# Altium schematic sheet SHDN-BSPD-S09-V00-PSU.SchDoc: Power Supply (20-40V to 3v3 @ 0.1-0.6A)
size A3; DrawnBy: Jonn Dillon; DocumentNumber: 9; Revision: 01; SheetNumber: 9; SheetTotal: 12; Version: 01; Project: Battery Management System 2020; PageSetup: Record=PageOptions|CenterHorizontal=True|CenterVertical=True|PrintScale=0.97|XCorrection=1.00|YCorrection=1.00|PrintKind=0|BorderSize=5000000|LeftOffset=0|BottomOffset=0|Orientation=2|PaperLength=1000|PaperWidth=1000|Scale=100|PaperSource=7|PrintQuality=-4|MediaType=1|DitherType=10|PaperKind=A4|PrintScaleMode=1
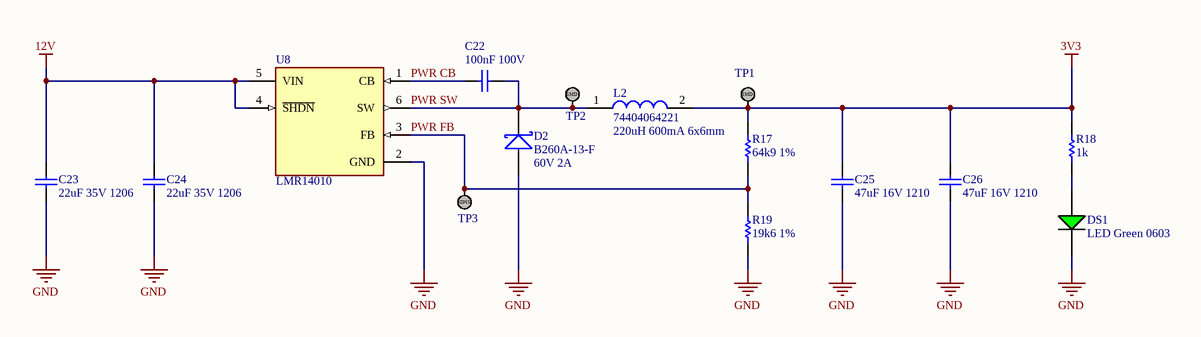
[diagram p0: SHDN-BSPD-S09-V00-PSU.SchDoc]

## Parts
C22  100nF 100V  [Cap_Ceramic_0603]
C23  22uF 35V 1206  [Cap_Ceramic_1206]
C24  22uF 35V 1206  [Cap_Ceramic_1206]
C25  47uF 16V 1210  [Cap_Ceramic_1210]
C26  47uF 16V 1210  [Cap_Ceramic_1210]
D2  B260A-13-F  [SMA]
DS1  LED Green 0603  [LED GREEN 0603]
L2  74404064221  [Inductor_6x6mm]
R17  64k9 1%  [Res_ThinFilm_0603]
R18  1k  [Res_ThinFilm_0603]
R19  19k6 1%  [Res_ThinFilm_0603]
TP1  TestPoint_SMD  [TestPointSMD]  (value not drawn)
TP2  TestPoint_SMD  [TestPointSMD]  (value not drawn)
TP3  TestPoint_SMD  [TestPointSMD]  (value not drawn)
U8  LMR14010  [LMR14010]

## Nets
3V3: C25.2 C26.2 L2.2 R17.2 R18.2 TP1.1
12V: C23.2 C24.2 U8.4(~{SHDN}) U8.5(VIN)
GND: C23.1 C24.1 C25.1 C26.1 D2.A DS1.2(C) R19.1 U8.2(GND)
PWR CB: C22.1 U8.1(CB)
PWR FB: R17.1 R19.2 TP3.1 U8.3(FB)
PWR SW: C22.2 D2.K L2.1 TP2.1 U8.6(SW)
NetDS1_1: DS1.1(A) R18.1

## Notes on the sheet
- (near L2) 220uH 600mA 6x6mm
- (near D2) 60V 2A
- Revision History:
- Sheet Title:
- Rev
- Date
- Description
- Project:
- Size:
- Drawn By:
- A3
- Number:
- Revision:
- Sheet
- Version:
- of
- QUT Motorsport
- O-120, Gardens Point
- 2 George Street
- Brisbane, QLD 4000
- Australia
- Print Date:
- Print Time:
- File Name:
- (in symbol TestPoint_SMD) SMD

## Library data of the parts
C22 = 100nF 100V 5% X7R 0603: Capacitor, Ceramic, SMD, 100nF, 100V, 5%, X7R, 0603
C23 C24 = 22uF 35V 10% X7R 1206: Capacitor, Ceramic, SMD, 22uF, 35V, 10%, X7R, 1206
C25 C26 = 47uF 16V 10% X7R 1210: Capacitor, Ceramic, SMD, 47uF, 16V, 5%, X7R, 1210
D2 = B260A-13-F: Diode, Schottky Barrier Rectifier, 60 V, 2 A, B260A-13-F
L2 = 74404064221: FIXED IND 220UH 660MA 850 MOHM; ComponentLink1Description: Digikey; ComponentLink1URL: https://www.digikey.com.au/product-detail/en/w%C3%BCrth-elektronik/74404064221/732-7261-1-ND/5353241; ComponentLink2Description: LCSC A; ComponentLink2URL: https://lcsc.com/product-detail/Power-Inductors_Sunlord-SWPA6045S221MT_C91047.html; ComponentLink3Description: LCSC B; ComponentLink3URL: https://lcsc.com/product-detail/Power-Inductors_SXN-Shun-Xiang-Nuo-Elec-SMNR6045-221MT_C467145.html
R17 = 64k9 1% 0603: Resistor, SMD, 64k9, 0.1W, 5%, 0603
R18 = 1k 5% 0603: Resistor, SMD, 1k, 0.1W, 5%, 0603
R19 = 19k6 1% 0603: Resistor, SMD, 19k6, 0.1W, 5%, 0603